# Altium schematic sheet Glossary.SchDoc
size A4; Organization: BrickRed Systems; Address1: 2509 152nd Ave NE; Address2: Suite B; Address3: Redmond, WA 98052; SheetNumber: 6; SheetTotal: 6; PageSetup: Record=PageOptions|CenterHorizontal=True|CenterVertical=True|PrintScale=1.00|XCorrection=1.00|YCorrection=1.00|PrintKind=1|BorderSize=5000000|LeftOffset=0|BottomOffset=0|Orientation=2|PaperLength=1000|PaperWidth=1000|Scale=100|PaperSource=7|PrintQuality=600|MediaType=1|DitherType=10|PaperKind=Letter|PrintScaleMode=1
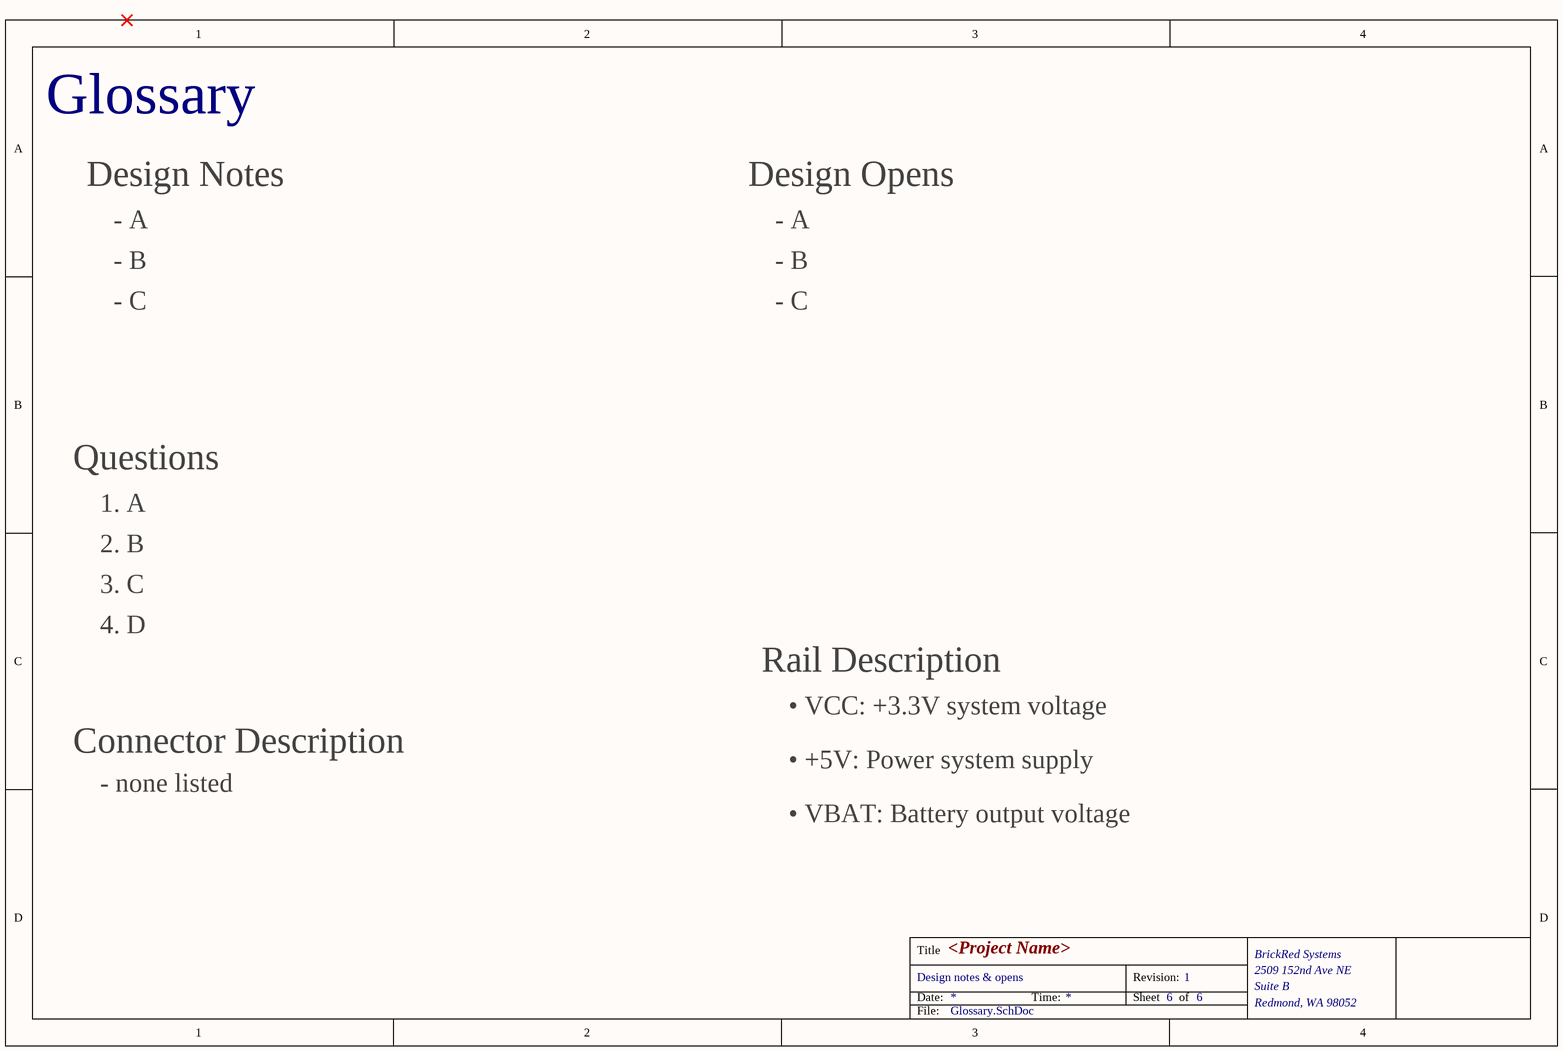
[diagram p0: Glossary.SchDoc]

## Notes on the sheet
- Glossary
- Design Notes
- Design Opens
- - A
- - B
- - C
- Questions
- 1. A
- 2. B
- 3. C
- 4. D
- Rail Description
- • VCC: +3.3V system voltage
- Connector Description
- - none listed
- • +5V: Power system supply
- • VBAT: Battery output voltage
- Title
- Date:
- Design notes & opens
- <Project Name>
- Time:
- Revision:
- Sheet
- of
- 1
- File: